# Altium schematic sheet PROC099B_CoverSheet.SchDoc
size 431 x 279 mm; Date: Not shown in title block; ApprovedBy: Not shown in title block; CheckedBy: Not shown in title block; Author: Not shown in title block; CompanyName: Not shown in title block; DrawnBy: Adrian Ozer; Engineer: Not shown in title block; Organization: Not shown in title block; Address1: Not shown in title block; Address2: Not shown in title block; Address3: Not shown in title block; Address4: Not shown in title block; DocumentNumber: 1; Revision: Use project parameter SCH_Rev; SheetNumber: 1; SheetTotal: 16; PageSetup: Record=PageOptions|CenterHorizontal=True|CenterVertical=True|PrintScale=1.00|XCorrection=1.00|YCorrection=1.00|PrintKind=0|BorderSize=5000000|LeftOffset=0|BottomOffset=0|Orientation=2|PaperLength=1000|PaperWidth=1000|Scale=100|PaperSource=15|PrintQuality=600|MediaType=1|DitherType=10|PaperKind=Letter|PrintScaleMode=1; CurrentTime: Not shown in title block; CurrentDate: Not shown in title block; Time: Not shown in title block; DocumentFullPathAndName: Not shown in title block; DocumentName: Not shown in title block; ModifiedDate: Not shown in title block; ImagePath: Not shown in title block
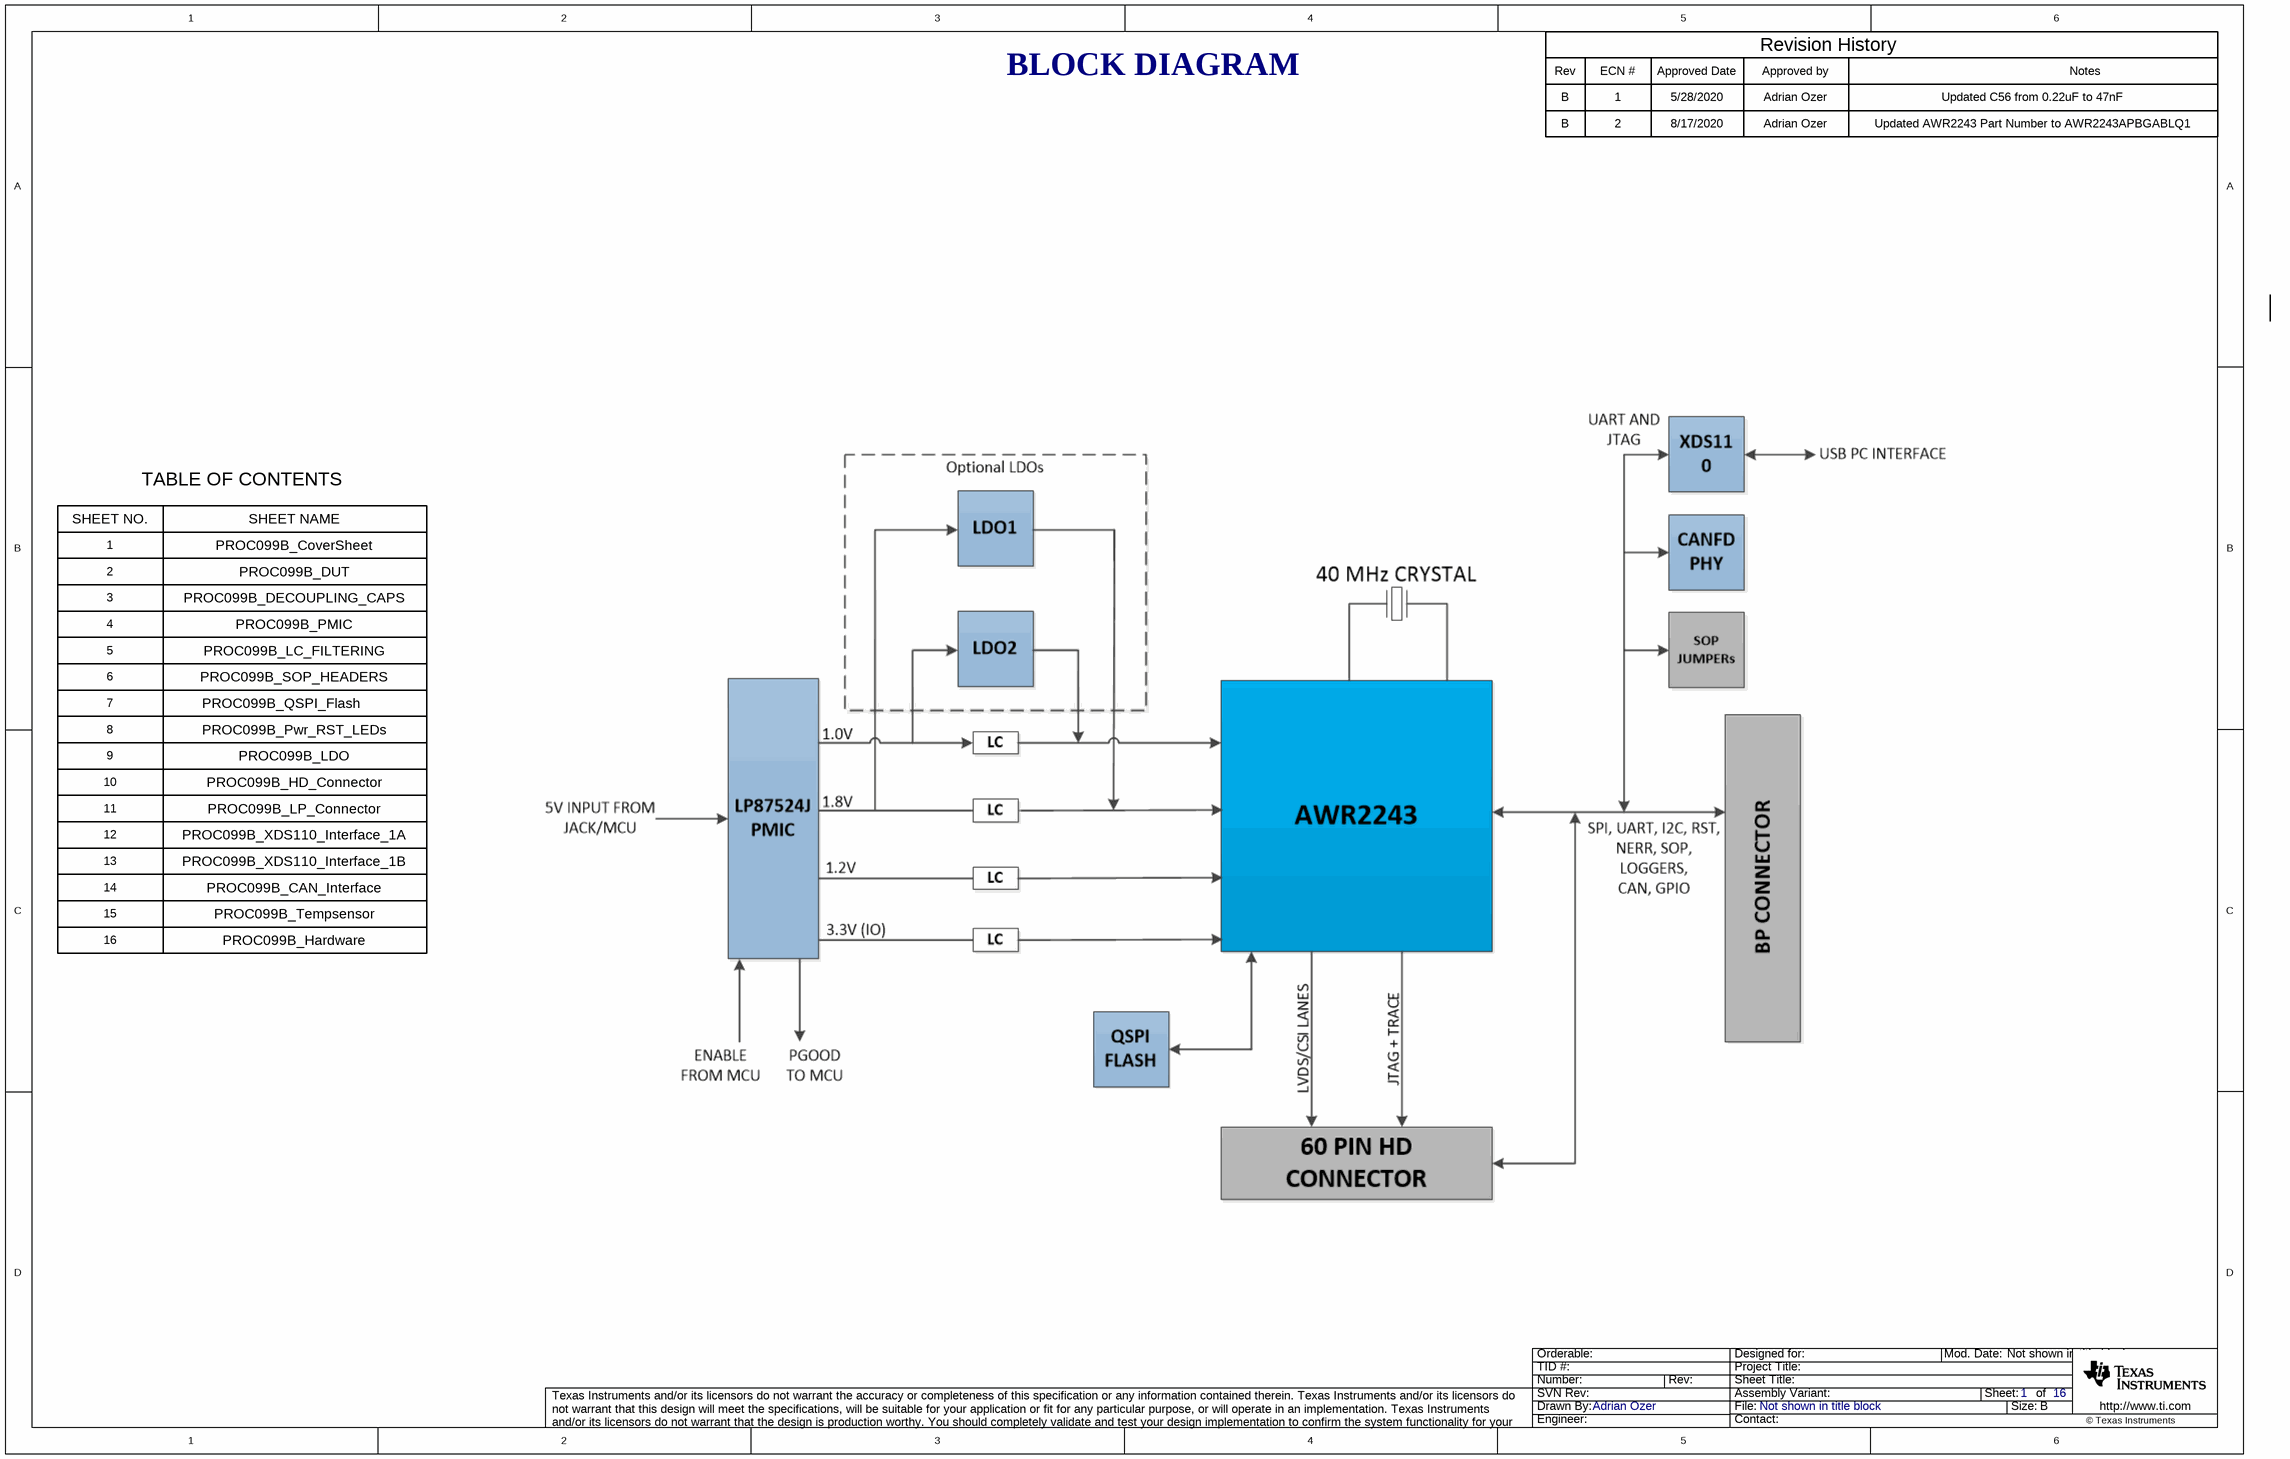
[diagram p0: PROC099B_CoverSheet.SchDoc]

## Notes on the sheet
- BLOCK DIAGRAM
- Rev
- B
- ECN #
- 1
- Approved Date
- 5/28/2020
- Approved by
- Adrian Ozer
- Revision History
- Updated C56 from 0.22uF to 47nF
- Notes
- 2
- 8/17/2020
- Updated AWR2243 Part Number to AWR2243APBGABLQ1
- TABLE OF CONTENTS
- SHEET NO.
- SHEET NAME
- PROC099B_CoverSheet
- 3
- 4
- PROC099B_DUT
- PROC099B_DECOUPLING_CAPS
- PROC099B_PMIC
- 5
- 6
- PROC099B_LC_FILTERING
- PROC099B_SOP_HEADERS
- 7
- 8
- 9
- PROC099B_QSPI_Flash
- PROC099B_Pwr_RST_LEDs
- PROC099B_LDO
- 11
- 10
- PROC099B_HD_Connector
- PROC099B_LP_Connector
- 12
- 13
- 14
- PROC099B_XDS110_Interface_1A
- PROC099B_XDS110_Interface_1B
- PROC099B_CAN_Interface
- 15
- 16
- PROC099B_Tempsensor
- PROC099B_Hardware
- Drawn By:
- SVN Rev:
- Number:
- TID #:
- Orderable:
- Rev:
- Sheet Title:
- File:
- Project Title:
- Designed for:
- Assembly Variant:
- Mod. Date:
- Sheet:
- Size:
- of
- http://www.ti.com
- Texas Instruments and/or its licensors do not warrant the accuracy or completeness of this specification or any information contained therein. Texas Instruments and/or its licensors do not warrant that this design will meet the specifications, will be suitable for your application or fit for any particular purpose, or will operate in an implementation. Texas Instruments and/or its licensors do not warrant that the design is production worthy. You should completely validate and test your design implementation to confirm the system functionality for your application.
- Engineer:
- Contact:
- © Texas Instruments